# EAGLE design remote (EAGLE 4.16)
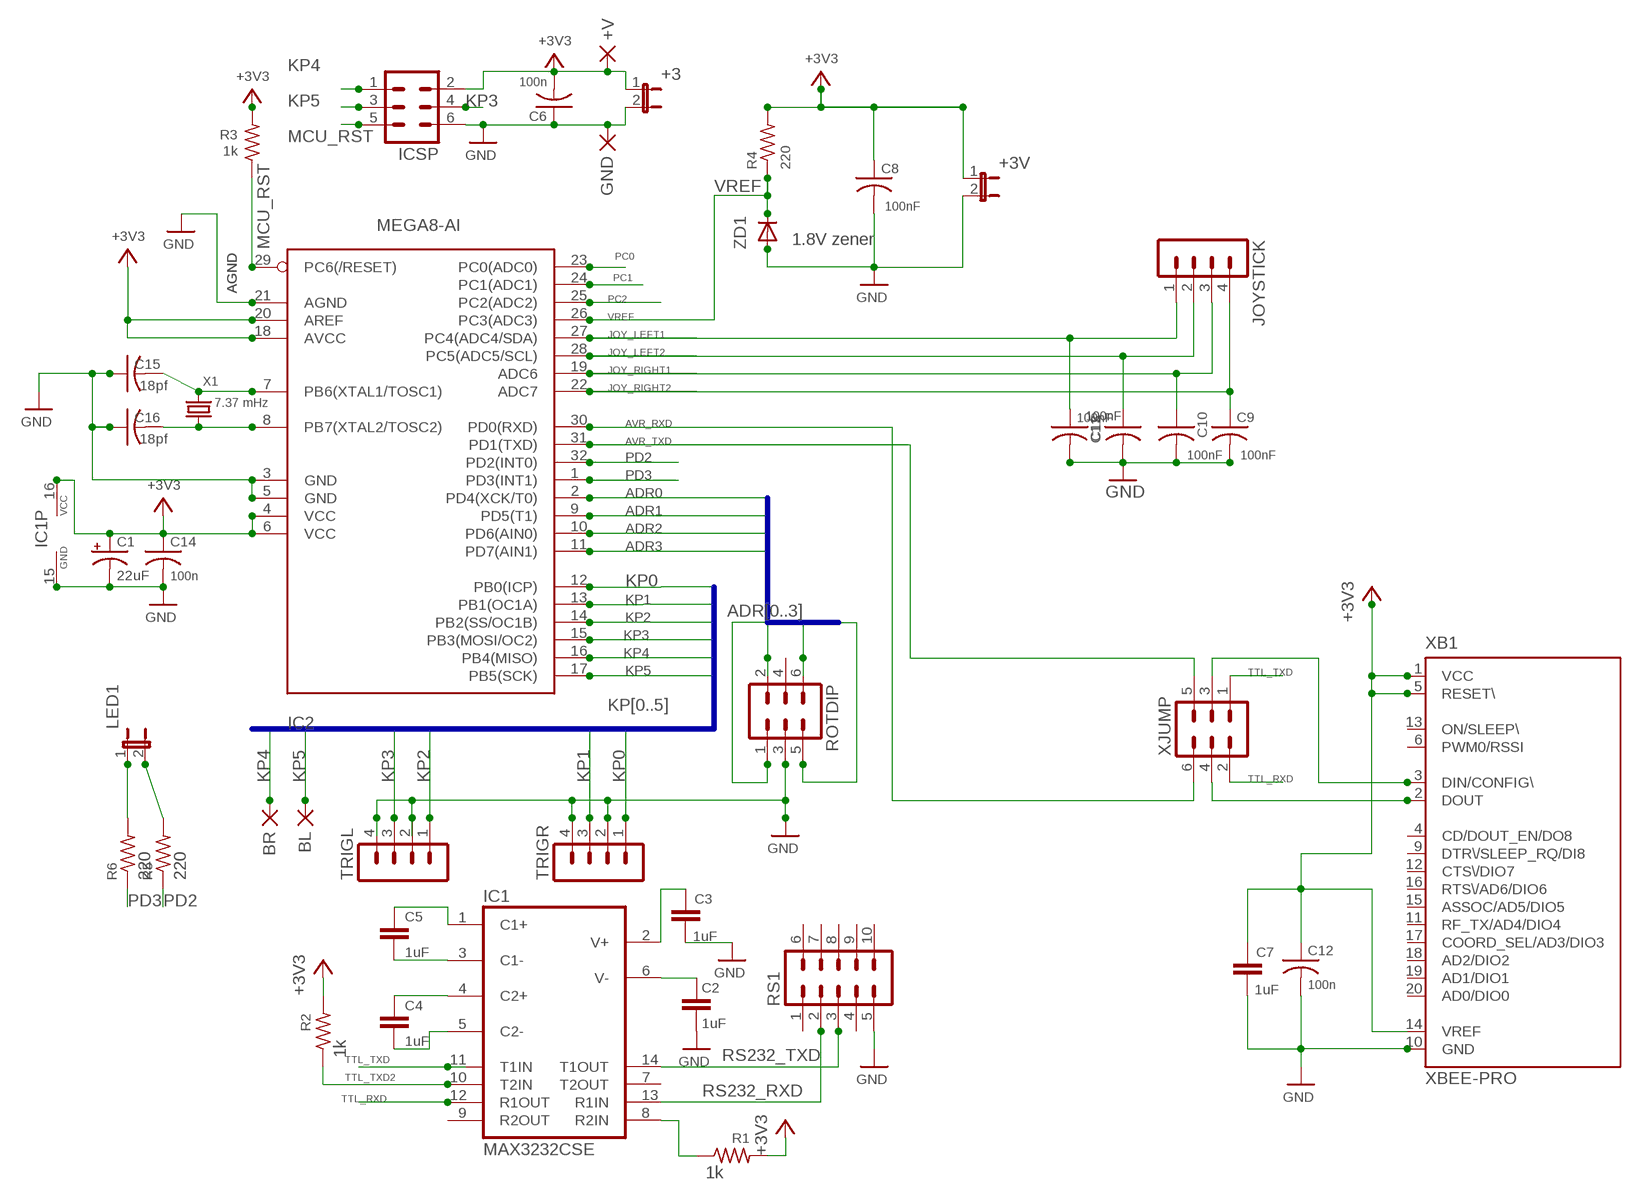
[diagram p0: schematic, sheet 1]

## Parts
+3  JP1E  [JP1]
+3V  JP1E  [JP1]
+V  PAD-0280  [0280]
BL  PAD-0280  [0280]
BR  PAD-0280  [0280]
C1  22uF  CPOL-USCT7343  [CT7343]
C2  1uF  C-EUC1206  [C1206]
C3  1uF  C-EUC1206  [C1206]
C4  1uF  C-EUC1206  [C1206]
C5  1uF  C-EUC1206  [C1206]
C6  100n  C-USC1206  [C1206]
C7  1uF  C-EUC1206  [C1206]
C8  100nF  C-USC1206  [C1206]
C9  100nF  C-USC1206  [C1206]
C10  100nF  C-USC1206  [C1206]
C11  100nF  C-USC1206  [C1206]
C12  100n  C-USC1206  [C1206]
C13  100nF  C-USC1206  [C1206]
C14  100n  C-USC1206  [C1206]
C15  18pf  C-USC1206  [C1206]
C16  18pf  C-USC1206  [C1206]
GND  PAD-0280  [0280]
IC1  MAX3232CSE  [SO16]
IC2  MEGA8-AI  [TQFP32-08]
ICSP  MA03-2  [MA03-2]
JOYSTICK  MA04-1  [MA04-1]
LED1  JP1E  [JP1]
R1  1k  R-US_M1206  [M1206]
R2  1k  R-US_M1206  [M1206]
R3  1k  R-US_M1206  [M1206]
R4  220  R-US_M1206  [M1206]
R5  220  R-US_M1206  [M1206]
R6  220  R-US_M1206  [M1206]
ROTDIP  MA03-2  [MA03-2]
RS1  COMHEADER-M  [MA05-2]
TRIGL  MA04-1  [MA04-1]
TRIGR  MA04-1  [MA04-1]
X1  7.37 mHz  CRYSTALHC49UP  [HC49UP]
XB1  XBEE-PRO  [XBEE-PRO]
XJUMP  MA03-2  [MA03-2]
ZD1  1.8V zener  DIODE-SOD123  [SOD123]

## Nets
+3V3 [GND]: +3.1 +3V.1 +V.P$1(P) C1.+ C6.2 C7.1 C8.1 C12.1 C14.1 IC1.16(VCC) IC2.4(VCC) IC2.6(VCC) IC2.18(AVCC) IC2.20(AREF) ICSP.2 R1.2 R2.2 R3.2 R4.2 XB1.1(VCC) XB1.5(RESET\) XB1.14(VREF)
ADR0: IC2.2(PD4(XCK/T0)) ROTDIP.1
ADR1: IC2.9(PD5(T1)) ROTDIP.5
ADR2: IC2.10(PD6(AIN0)) ROTDIP.2
ADR3: IC2.11(PD7(AIN1)) ROTDIP.6
AVR_RXD: IC2.30(PD0(RXD)) XJUMP.6
AVR_TXD: IC2.31(PD1(TXD)) XJUMP.5
GND [GND]: +3.2 +3V.2 C1.- C2.2 C3.2 C6.1 C7.2 C8.2 C9.2 C10.2 C11.2 C12.2 C13.2 C14.2 C15.1 C16.1 GND.P$1(P) IC1.15(GND) IC2.3(GND) IC2.5(GND) IC2.21(AGND) ICSP.6 ROTDIP.3 RS1.5 TRIGL.2 TRIGL.4 TRIGR.2 TRIGR.4 XB1.10(GND) ZD1.A
JOY_LEFT1: C13.1 IC2.27(PC4(ADC4/SDA)) JOYSTICK.1
JOY_LEFT2: C11.1 IC2.28(PC5(ADC5/SCL)) JOYSTICK.2
JOY_RIGHT1: C10.1 IC2.19(ADC6) JOYSTICK.3
JOY_RIGHT2: C9.1 IC2.22(ADC7) JOYSTICK.4
KP0: IC2.12(PB0(ICP)) TRIGR.1
KP1: IC2.13(PB1(OC1A)) TRIGR.3
KP2: IC2.14(PB2(SS/OC1B)) TRIGL.1
KP3: IC2.15(PB3(MOSI/OC2)) ICSP.4 TRIGL.3
KP4: BR.P$1(P) IC2.16(PB4(MISO)) ICSP.1
KP5: BL.P$1(P) IC2.17(PB5(SCK)) ICSP.3
MCU_RST: IC2.29(PC6(/RESET)) ICSP.5 R3.1
N$1: IC1.8(R2IN) R1.1
N$3: LED1.2 R5.2
N$4 [GND]: C15.2 IC2.7(PB6(XTAL1/TOSC1)) X1.2
N$5: LED1.1 R6.2
N$7: C2.1 IC1.6(V-)
N$9 [GND]: C16.2 IC2.8(PB7(XTAL2/TOSC2)) X1.1
N$10: C4.1 IC1.4(C2+)
N$11: C3.1 IC1.2(V+)
N$12: C4.2 IC1.5(C2-)
N$13: C5.2 IC1.3(C1-)
N$15: C5.1 IC1.1(C1+)
PC0: IC2.23(PC0(ADC0))
PC1: IC2.24(PC1(ADC1))
PC2: IC2.25(PC2(ADC2))
PD2: IC2.32(PD2(INT0)) R5.1
PD3: IC2.1(PD3(INT1)) R6.1
RS232_RXD: IC1.13(R1IN) RS1.2
RS232_TXD: IC1.14(T1OUT) RS1.3
TTL_RXD: IC1.12(R1OUT) XJUMP.2
TTL_TXD: IC1.11(T1IN) XJUMP.1
TTL_TXD2: IC1.10(T2IN) R2.1
VREF: IC2.26(PC3(ADC3)) R4.1 ZD1.C
XB_SEND: XB1.3(DIN/CONFIG\) XJUMP.3
XBEE_RCV: XB1.2(DOUT) XJUMP.4
Unconnected: IC1.7(T2OUT) IC1.9(R2OUT) ROTDIP.4 RS1.1 RS1.4 RS1.6 RS1.7 RS1.8 RS1.9 RS1.10 XB1.4(CD/DOUT_EN/DO8) XB1.6(PWM0/RSSI) XB1.9(DTR\/SLEEP_RQ/DI8) XB1.11(RF_TX/AD4/DIO4) XB1.12(CTS\/DIO7) XB1.13(ON/SLEEP\) XB1.15(ASSOC/AD5/DIO5) XB1.16(RTS\/AD6/DIO6) XB1.17(COORD_SEL/AD3/DIO3) XB1.18(AD2/DIO2) XB1.19(AD1/DIO1) XB1.20(AD0/DIO0)

## Buses
ADR[0..3]
KP[0..5]

## Notes on the sheet
- AGND | AGND

## Library data of the parts
+3 +3V LED1 = jumper:JP1E: JUMPER
+V BL BR GND = dpads:PAD: WIRE PAD Standard US Drill Sizes and SMD pads
C1 = rcl:CPOL-US: POLARIZED CAPACITOR, American symbol
C2-C5 C7 = rcl:C-EU: CAPACITOR, European symbol
C6 C8-C16 = rcl:C-US: CAPACITOR, American symbol
IC1 = maxim:MAX3232*: True RS-232 Transceivers 3.0V to 5.5V, Low-Power up to 1Mbps, Using Four 0.1µF External Capacitors Source: http://pdfserv.maxim-ic.com/en/ds/MAX3222-MAX3241.pdf
IC2 = atmel:MEGA8: MICROCONTROLLER 8 Kbytes FLASH 1 kbytes SRAM 512 bytes EEPROM USART 6-channel 10 bit ADC 2-channel 8 bit ADC Source: avr.lbr
ICSP ROTDIP XJUMP = con-lstb:MA03-2: PIN HEADER
JOYSTICK TRIGL TRIGR = con-lstb:MA04-1: PIN HEADER
R1-R6 = rcl:R-US_: RESISTOR, American symbol
RS1 = foote:COMHEADER-M
X1 = crystal:CRYSTAL: CRYSTAL
XB1 = maxstream:XBEE: XBee (TM) /XBee-PRO(TM) OEM RF Modules Source: MaxStream, Inc. xbee_productmanual.pdf
ZD1 = diode:DIODE-: DIODE

## Board
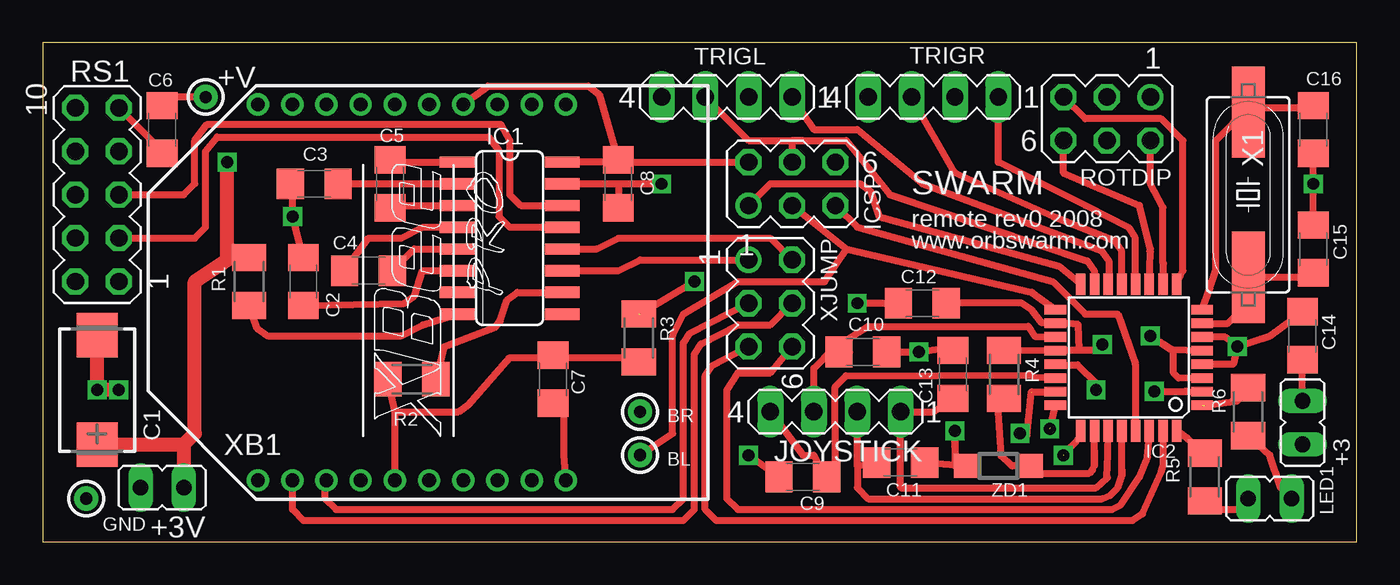
[diagram p1: board, top side]
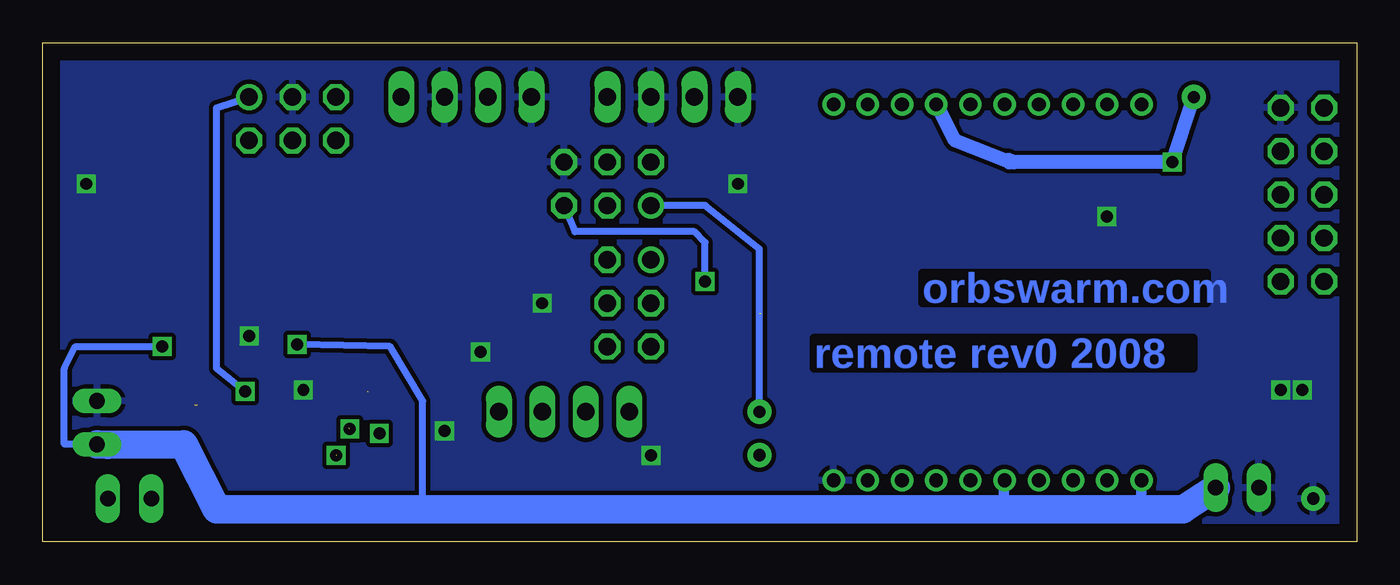
[diagram p2: board, bottom side, seen from below]

Size 76.83 x 29.21 mm. Coordinates in mm from the lower left corner, seen from the top.
Outline: 0,0 76.83,0 76.83,29.21 0,29.21 0,0
Copper layers (1*16): Top 0.035mm / dielectric 1.5mm / Bottom 0.035mm
Design rules "default": minimum track width 10mil, minimum drill 24mil, track to track 8mil, track to pad 8mil, pad to pad 8mil, via to via 8mil, smd to smd 8mil, copper to edge 40mil, drill to drill 8mil, minimum pad ring 10mil, minimum via ring 8mil, stop-mask expansion 4mil, vias tented up to drill 0mil, thermal gap 10mil

### Footprints (pad centres in the part's own frame; a part is rotated, then mirrored left to right if it is on the bottom)
JP1 = drill 0.914 long: 1 0,-1.27; 2 0,1.27
0280 = drill 0.711 pad 1.422 round: P$1 0,0
CT7343 = smd 2.6 x 2.4: + 3.2,0; - -3.2,0
C1206 = smd 1.6 x 1.8: 1 -1.4,0; 2 1.4,0
SO16 = smd 0.66 x 2.032: 1 -4.445,-3.073; 2 -3.175,-3.073; 3 -1.905,-3.073; 4 -0.635,-3.073; 5 0.635,-3.073; 6 1.905,-3.073; 7 3.175,-3.073; 8 4.445,-3.073; 9 4.445,3.073; 10 3.175,3.073; 11 1.905,3.073; 12 0.635,3.073; 13 -0.635,3.073; 14 -1.905,3.073; 15 -3.175,3.073; 16 -4.445,3.073
TQFP32-08 = smd 1.27 x 0.559: 1 -4.293,2.8; 2 -4.293,2; 3 -4.293,1.2; 4 -4.293,0.4; 5 -4.293,-0.4; 6 -4.293,-1.2; 7 -4.293,-2; 8 -4.293,-2.8; 17 4.293,-2.8; 18 4.293,-2; 19 4.293,-1.2; 20 4.293,-0.4; 21 4.293,0.4; 22 4.293,1.2; 23 4.293,2; 24 4.293,2.8 | smd 0.559 x 1.27: 9 -2.8,-4.293; 10 -2,-4.293; 11 -1.2,-4.293; 12 -0.4,-4.293; 13 0.4,-4.293; 14 1.2,-4.293; 15 2,-4.293; 16 2.8,-4.293; 25 2.8,4.293; 26 2,4.293; 27 1.2,4.293; 28 0.4,4.293; 29 -0.4,4.293; 30 -1.2,4.293; 31 -2,4.293; 32 -2.8,4.293
MA03-2 = drill 1.016 round: 1 -2.54,-1.27 | drill 1.016 octagon: 2 -2.54,1.27; 3 0,-1.27; 4 0,1.27; 5 2.54,-1.27; 6 2.54,1.27
MA04-1 = drill 1.016 long: 1 -3.81,0; 2 -1.27,0; 3 1.27,0; 4 3.81,0
M1206 = smd 1.6 x 2: 1 -1.4,0; 2 1.4,0
MA05-2 = drill 1.016 octagon: 1 -5.08,-1.27; 2 -2.54,-1.27; 3 0,-1.27; 4 2.54,-1.27; 5 5.08,-1.27; 6 -5.08,1.27; 7 -2.54,1.27; 8 0,1.27; 9 2.54,1.27; 10 5.08,1.27
HC49UP = smd 5.334 x 1.93: 1 -4.826,0; 2 4.826,0
XBEE-PRO = drill 0.8 pad 1.27 round: 1 -11,9; 2 -11,7; 3 -11,5; 4 -11,3; 5 -11,1; 6 -11,-1; 7 -11,-3; 8 -11,-5; 9 -11,-7; 10 -11,-9; 11 11,-9; 12 11,-7; 13 11,-5; 14 11,-3; 15 11,-1; 16 11,1; 17 11,3; 18 11,5; 19 11,7; 20 11,9
SOD123 = smd 1.4 x 1.4: A 1.9,0; C -1.9,0

### Placement (x,y rotation side)
+3  73.66,6.99 0 top
+3V  6.99,3.17 90 top
+V  9.53,26.04 0 top
BL  34.92,5.08 0 top
BR  34.92,7.62 0 top
C1  3.17,8.89 270 top
C2  15.24,15.24 90 top
C3  15.88,20.95 180 top
C4  19.05,15.88 0 top
C5  20.32,20.95 270 top
C6  6.99,24.13 90 top
C7  29.84,9.53 270 top
C8  33.66,20.95 270 top
C9  44.45,3.81 180 top
C10  47.96,11.13 0 top
C11  50.16,4.65 0 top
C12  51.44,13.97 180 top
C13  53.21,9.8 90 top
C14  73.66,12.06 270 top
C15  74.3,17.14 270 top
C16  74.3,24.13 90 top
GND  2.54,2.54 0 top
IC1  27.3,17.78 270 top
IC2  63.5,10.79 180 top
ICSP  43.81,20.95 0 top
JOYSTICK  46.35,7.62 180 top
LED1  71.75,2.54 90 top
R1  12.06,15.24 90 top
R2  21.59,9.53 180 top
R3  34.85,11.94 270 top
R4  56.21,9.8 90 top
R5  67.94,3.81 270 top
R6  70.48,7.62 270 top
ROTDIP  62.23,24.77 180 top
RS1  3.17,20.32 90 top
TRIGL  40.01,26.04 180 top
TRIGR  52.07,26.04 180 top
X1  70.48,20.32 270 top
XB1  21.59,14.61 90 top
XJUMP  42.55,13.97 270 top
ZD1  55.88,4.45 180 top

### Tracks (layer width: path | path; a pad name or v marks a point on that pad's centre or on a via)
+3V3  (via drill 0.7)
  Top 0.406: IC2.20 61.7,11.2 61.92,11.43 v61.95,11.56 | IC2.4 69.61,10.39 v69.85,11.43 | C14.1 71.75,12.06 v69.85,11.43 | IC2.6 69.14,11.99 v69.85,11.43 | IC2.18 59.2,12.8 | IC2.20 60.6,11.23 60.55,12.72 59.28,12.85 IC2.18 | R4.2 55.83,11.18 IC2.20 | C12.1 57.23,13.97 57.84,13.59 58.42,12.83 59.31,12.78 IC2.18 | XB1.5 20.6,7.62 | 20.6,7.62 24.31,7.62 24.91,8.05 27.3,10.79 29.84,10.79 C7.1 29.21,10.79 34.29,10.79 34.92,10.16 R3.2 | 33.66,22.23 C8.1 arc12 34.29,22.23 ICSP.2 | 33.66,22.23 32.52,26.21 31.91,26.67 26.04,26.67 XB1.14 | 33.66,22.23 IC1.16 | 10.79,16.51 12.06,16.51 R1.2 | R2.2 20.32,8.89 20.6,7.62 | C6.2 7.62,26.04 +V.P$1
  Top 0.813: 8.26,5.71 +3V.1 | C1.+ 3.17,5.71 8.26,5.71 | 8.26,5.71 8.89,6.35 8.89,15.24 10.79,16.51 v10.79,22.23
  Bottom 0.406: v61.95,11.56 56.52,11.43 54.61,8.26 54.61,1.91 | v69.85,11.43 74.93,11.43 75.56,10.16 75.56,5.71 73.03,5.71 73.03,5.68
  Bottom 0.61: 20.62,1.91 20.62,2.72 XB1.5 | 10.16,1.91 12.62,1.93 XB1.1
  Bottom 0.813: XB1.14 24.66,25.78 23.5,23.5 20.32,22.23 20.39,22.36 20.06,22.23 v10.79,22.23 +V.P$1
  Bottom 1.676: +3V.1 10.16,1.91 20.62,1.91 54.61,1.91 66.67,1.91 68.58,5.71 73.03,5.68 +3.1
ADR0  (via drill 0.7)
  Top 0.406: 66.78,8.81 IC2.2 | v65,8.81 66.78,8.81 | 66.78,8.81 66.89,8.81
  Bottom 0.406: v65,8.81 66.67,10.16 66.67,25.4 ROTDIP.1
ADR1
  Top 0.406: IC2.9 66.67,15.88 66.67,23.5 65.41,24.77 60.96,24.77 ROTDIP.5
ADR2
  Top 0.406: IC2.10 65.53,15.12 65.53,16.28 | 65.53,16.28 65.53,16.31 | 65.53,16.28 65.51,16.28 65.51,19.58 64.77,20.95 ROTDIP.2
ADR3
  Top 0.406: IC2.11 64.77,16.97 | 64.77,16.97 64.72,17.01 | 64.77,16.97 64.77,17.14 64.14,19.68 59.69,21.59 ROTDIP.6
AVR_RXD
  Top 0.406: XJUMP.6 42.55,9.91 40.64,9.91 40.01,8.89 40.01,2.54 40.64,1.91 62.52,1.91 63.05,2.19 64.14,3.81 64.59,4.95 64.75,6.48 IC2.30
AVR_TXD
  Top 0.406: IC2.31 65.53,6.45 65.53,4.6 65.56,4.6 65.41,4.12 64.3,1.65 63.72,1.27 39.37,1.27 38.73,1.91 38.73,9.73 39.13,10.32 XJUMP.5
GND  (via drill 0.7)
  Top 0.406: IC2.21 59.24,10.36 60.5,10.36 61.59,9.27 v61.59,8.89 | 14.61,16.51 C2.2 v14.61,19.05 14.61,20.82 C3.2 | C9.2 v41.27,5.08 | C10.2 v51.23,11.12 53.34,11.43 C13.2 | C11.2 53.37,4.52 v53.34,6.5 53.34,4.45 ZD1.A | IC2.5 65.94,11.28 v64.77,12.06 66.12,11.2 66.12,9.88 66.42,9.58 IC2.3 | 74.3,18.41 C15.1 v74.3,20.95 C16.1 | +3.2 C14.2 | v47.62,13.97 C12.2 | 33.66,20.95 C8.2 | IC1.15 33.66,20.95 | 29.84,8.26 C7.2 30.48,8.26 30.48,5.08 XB1.10 | 33.66,20.95 v36.2,20.95 | C6.1 6.99,22.86 RS1.5
  Top 0.813: C1.- v3.17,8.89 v4.45,8.89
  pour Bottom (isolate 0.254, rank 2): 0.64,0.64 0,29.21 76.2,29.21 76.2,0.64
JOY_LEFT1
  Top 0.406: IC2.27 62.28,5.11 62.23,3.81 62.23,3.76 62.26,3.76 61.59,3.17 50.16,3.17 JOYSTICK.1 52.07,7.62 C13.1
JOY_LEFT2
  Top 0.406: IC2.28 63.09,4.88 63.09,4.65 | 63.09,4.65 63.09,4.04 63.12,3.89 | 63.12,3.89 63.09,4.65 | 47.62,4.45 JOYSTICK.2 | 47.62,4.45 47.62,3.17 48.26,2.54 61.97,2.54 62.42,2.73 62.87,3.17 63.09,3.86 63.12,3.89 | 47.62,4.45 C11.1
JOY_RIGHT1
  Top 0.406: IC2.19 59.43,11.96 58.01,12.04 57.63,12.62 48.26,12.62 46.28,11.35 | 46.28,11.35 45.09,10.16 JOYSTICK.3 | C10.1 47.19,11.1 46.28,11.35
JOY_RIGHT2
  Top 0.406: IC2.22 59.44,9.65 58.04,9.63 57.76,9.78 46.97,9.73 46.33,9.08 46.35,4.45 | 46.35,4.45 45.72,3.81 45.09,5.08 44.45,5.08 JOYSTICK.4 | 46.35,4.45 C9.1
KP0
  Top 0.406: IC2.12 63.88,15.11 63.88,17.8 63.54,18.36 60.96,19.68 55.88,22.23 TRIGR.1
KP1
  Top 0.406: IC2.13 63.09,17.02 62.69,17.61 59.05,19.05 53.34,21.59 TRIGR.3
KP2
  Top 0.406: IC2.14 62.33,15.12 62.33,16.45 61.91,17.04 60.33,17.63 51.44,20.95 47.62,24.13 45.09,24.13 TRIGL.1
KP3
  Top 0.406: IC2.15 61.5,15.85 61.08,16.45 49.53,20.32 46.99,23.5 44.45,23.5 | TRIGL.3 41.27,23.5 44.45,23.5 | ICSP.4 43.81,23.5 44.45,23.5
KP4
  Top 0.406: IC2.16 59.43,16.14 48.9,19.05 48.41,20.52 47.8,20.95 42.55,20.95 ICSP.1
  Bottom 0.406: ICSP.1 38.1,19.68 34.92,17.14 BR.P$1
KP5
  Top 0.406: IC2.17 57.84,14.61 57.86,14.61 46.99,17.14 | 46.99,17.14 ICSP.3 | BL.P$1 36.83,6.35 36.83,12.06 37.47,13.34 40.64,15.24 45.72,15.24 46.99,17.14
MCU_RST  (via drill 0.7)  (1 unrouted)
  Top 0.406: IC2.29 63.9,7.16 63.88,7.16 63.88,10.41 62.87,13.34 60.96,13.34 59.05,15.24 47.62,18.41 ICSP.5 | 34.92,13.34 v38.1,15.24
  Bottom 0.406: ICSP.5 45.72,18.16 38.73,18.16 38.1,17.53 v38.1,15.24
N$1
  Top 0.406: IC1.8 22.23,12.7 20.95,12.06 13.15,12.06 12.55,12.49 R1.1
N$3
  Top 0.406: LED1.2 69.85,1.91 67.31,1.91 R5.2
N$4
  Top 0.406: IC2.7 69.31,12.79 69.85,13.34 69.85,14.61 70.48,15.24 X1.2 74.04,15.49 74.3,15.24 C15.2
N$5
  Top 0.406: R6.2 71.75,5.08 72.39,3.17 LED1.1
N$7
  Top 0.406: C2.1 21.14,13.96 21.73,14.39 22.23,15.88 IC1.6
N$9
  Top 0.406: IC2.8 68.25,14.86 68.58,15.88 68.58,23.5 70.48,25.4 X1.1 71.12,25.4 74.3,25.4 C16.2
N$10
  Top 0.406: IC1.4 22.23,18.41 20.95,17.78 19.05,17.78 C4.1
N$11
  Top 0.406: 17.14,20.95 C3.1 IC1.2
N$12
  Top 0.406: C4.2 21.72,17.14 IC1.5 24.77,17.14
N$13
  Top 0.406: C5.2 20.32,19.68 IC1.3
N$15
  Top 0.406: C5.1 20.32,22.23 IC1.1
PC0  (via drill 0.7)  (1 unrouted)
  Top 0.406: IC2.23 57.84,8.79 | v57.15,6.35 57.56,6.22 57.81,8.79
PC1  (via drill 0.7)  (1 unrouted)
  Top 0.406: 59.04,6.76 58.93,6.68 IC2.24
  other vias: 58.88,6.63
PC2  (via drill 0.7)  (1 unrouted)
  Top 0.406: IC2.25 60.71,6.17 59.69,5.11
  other vias: 59.69,5.08
PD2
  Top 0.406: IC2.32 66.95,6.02 67.94,5.08 R5.1
PD3  (1 unrouted)
  Top 0.406: R6.1 70.48,8.89 69.85,8.26 67.94,8 67.92,8.03
RS232_RXD
  Top 0.406: RS1.2 8.89,17.78 9.53,18.41 9.53,22.86 10.19,23.7 26.06,23.7 26.67,22.86 26.67,19.05 27.3,18.41 IC1.13 31.11,18.41
RS232_TXD
  Top 0.406: RS1.3 8.26,20.32 8.89,20.95 8.89,23.5 9.63,24.43 26.77,24.43 27.3,23.5 27.3,20.32 27.94,19.68 IC1.14
TTL_RXD
  Top 0.406: IC1.12 32.38,17.14 33.66,17.78 42.55,17.78 XJUMP.2
TTL_TXD
  Top 0.406: IC1.11 33.66,15.88 34.92,16.51 XJUMP.1
TTL_TXD2
  Top 0.406: IC1.10 27.76,14.61 27.16,14.17 26.74,12.92 26.47,12.58 23.5,11.43 23.23,10.39 | 23.23,10.39 23.14,10.03 | 23.23,10.39 23.24,10.39 R2.1
VREF
  Top 0.406: 61.49,5.33 IC2.26 | 61.49,5.33 61.49,4.6 | 61.49,5.33 61.49,4.47 61.38,4.22 61.2,4.03 60.53,4.01 57.81,4.01 ZD1.C 56.68,4.45 56.05,5.04 55.88,7.62 R4.1
XB_SEND
  Top 0.406: XB1.3 16.51,3.81 16.51,2.54 17.14,1.91 36.83,1.91 37.47,2.54 37.47,11.65 37.85,12.23 XJUMP.3
XBEE_RCV
  Top 0.406: XJUMP.4 42.55,12.7 40.64,12.7 38.5,11.59 38.1,11 38.1,1.91 37.47,1.27 15.24,1.27 14.61,1.91 14.61,3.81 XB1.2

### Text on the board
Bottom: orbswarm.com | remote rev0 2008
tNames: SWARM | remote rev0 2008 | www.orbswarm.com